# Altium schematic sheet GMSL_DESERIALIZER.SchDoc
size C; SheetNumber: 14; SheetTotal: 17
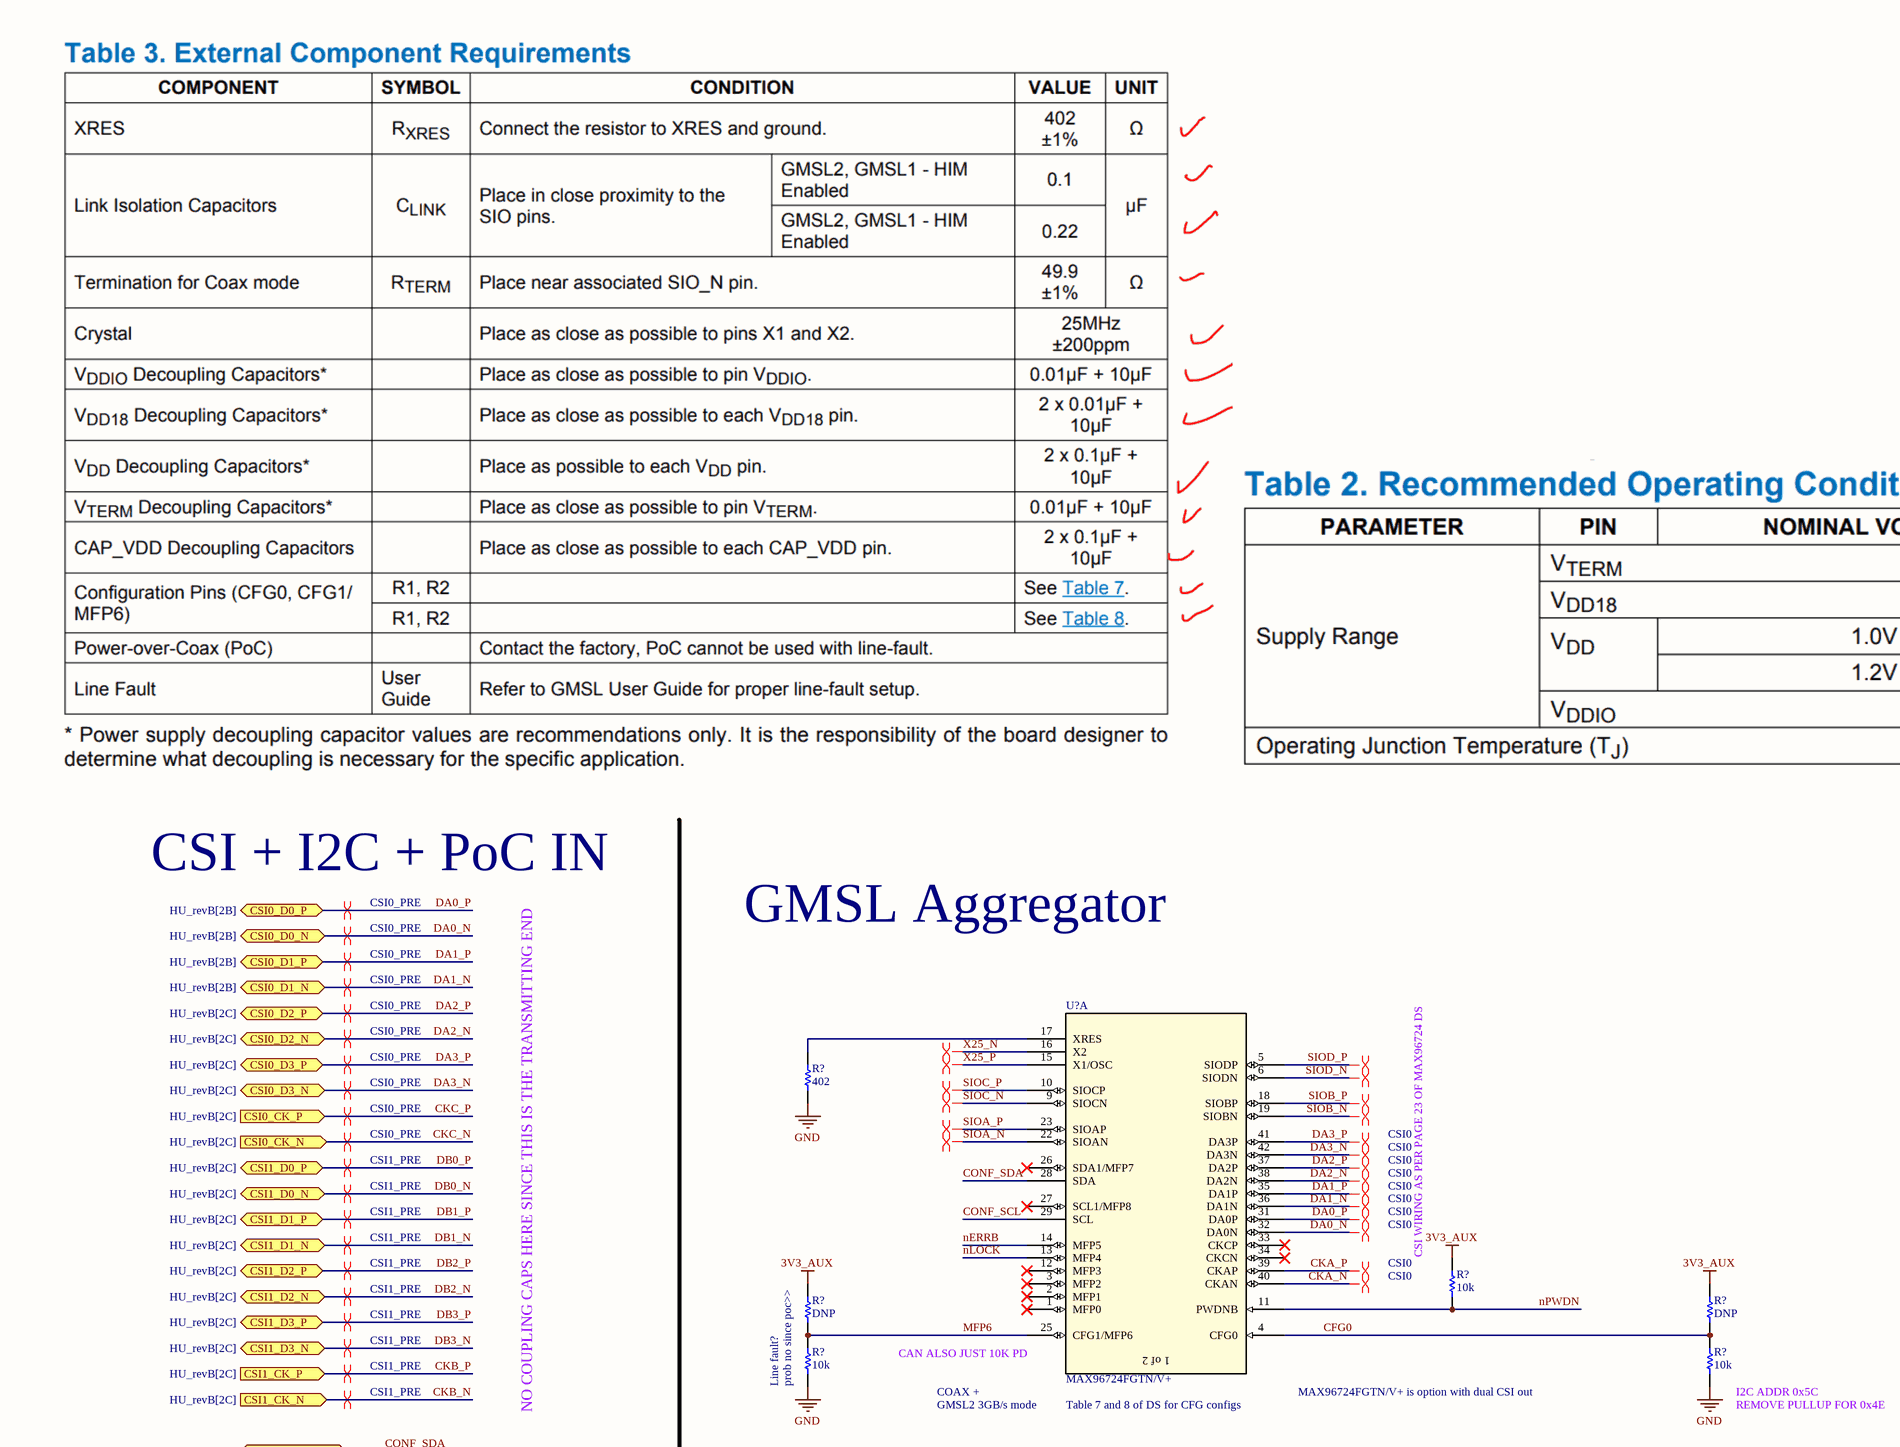
[diagram p0: GMSL_DESERIALIZER.SchDoc, top left]
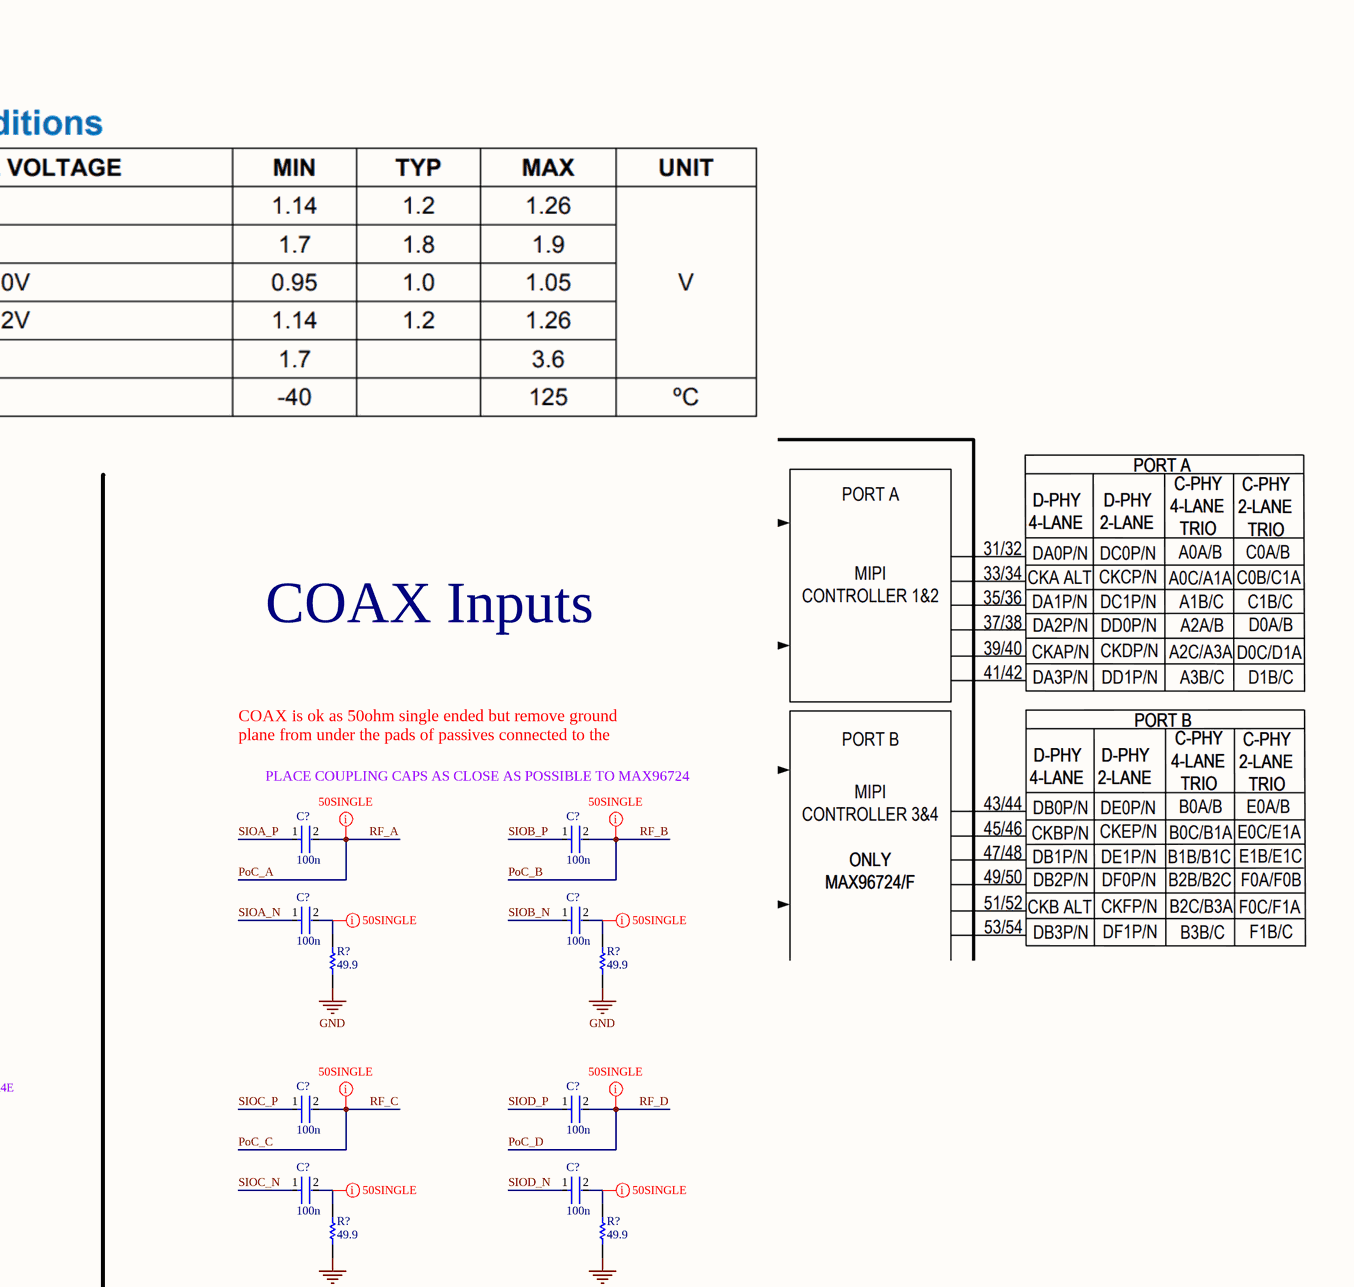
[diagram p1: GMSL_DESERIALIZER.SchDoc, top right]
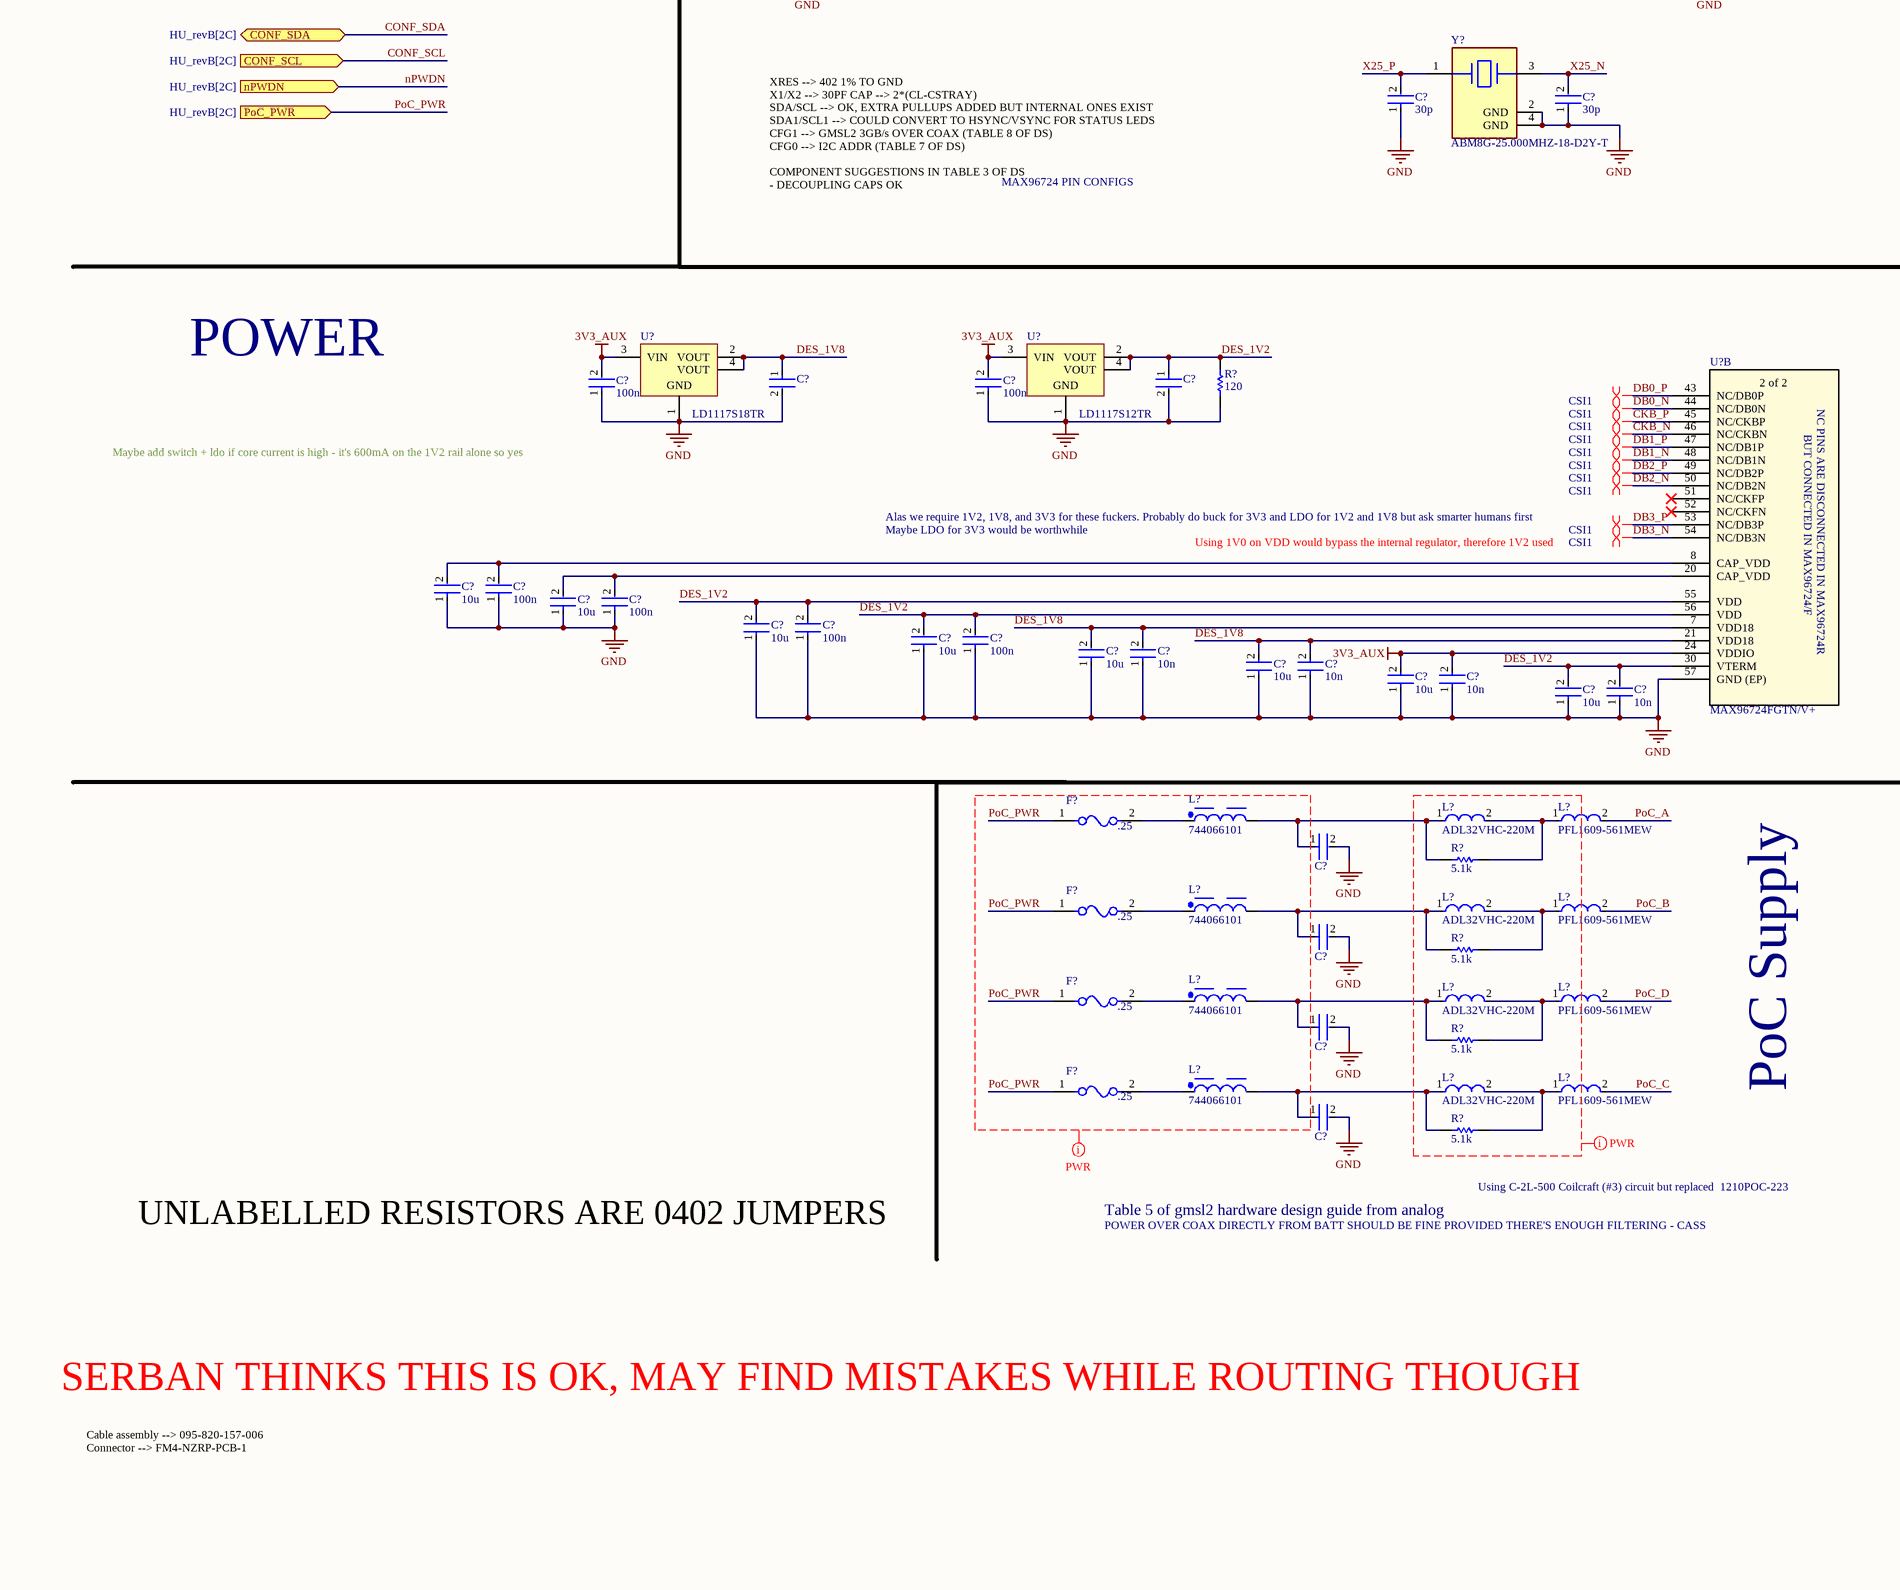
[diagram p2: GMSL_DESERIALIZER.SchDoc, bottom left]
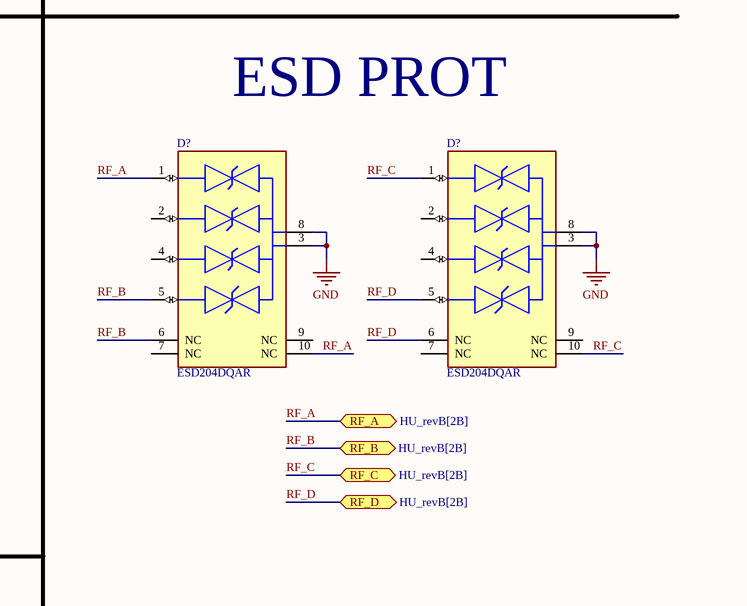
[diagram p3: GMSL_DESERIALIZER.SchDoc, bottom right]

## Parts
(Parts that share a designator on the sheet are numbered #1, #2 ... from top to bottom, then left to right.)
C?#1  100n  [FP-0402-L_1_0_0_05-W_0_5-IPC_A]
C?#2  100n  [FP-0402-L_1_0_0_05-W_0_5-IPC_A]
C?#3  100n  [FP-0402-L_1_0_0_05-W_0_5-IPC_A]
C?#4  100n  [FP-0402-L_1_0_0_05-W_0_5-IPC_A]
C?#5  100n  [FP-0402-L_1_0_0_05-W_0_5-IPC_A]
C?#6  100n  [FP-0402-L_1_0_0_05-W_0_5-IPC_A]
C?#7  100n  [FP-0402-L_1_0_0_05-W_0_5-IPC_A]
C?#8  100n  [FP-0402-L_1_0_0_05-W_0_5-IPC_A]
C?#9  30p  [FP-0402-L_1_0_0_05-W_0_5-IPC_A]
C?#10  30p  [FP-0402-L_1_0_0_05-W_0_5-IPC_A]
C?#11  GRM188R60J106ME47D  [FP-GRM188-0_1-e0_2_0_55-IPC_A]  (value not drawn)
C?#12  GRM188R60J106ME47D  [FP-GRM188-0_1-e0_2_0_55-IPC_A]  (value not drawn)
C?#13  100n  [FP-0402-L_1_0_0_05-W_0_5-IPC_A]
C?#14  100n  [FP-0402-L_1_0_0_05-W_0_5-IPC_A]
C?#15  10u  [FP-0402-L_1_0_0_05-W_0_5-IPC_A]
C?#16  100n  [FP-0402-L_1_0_0_05-W_0_5-IPC_A]
C?#17  10u  [FP-0402-L_1_0_0_05-W_0_5-IPC_A]
C?#18  100n  [FP-0402-L_1_0_0_05-W_0_5-IPC_A]
C?#19  10u  [FP-0402-L_1_0_0_05-W_0_5-IPC_A]
C?#20  100n  [FP-0402-L_1_0_0_05-W_0_5-IPC_A]
C?#21  10u  [FP-0402-L_1_0_0_05-W_0_5-IPC_A]
C?#22  100n  [FP-0402-L_1_0_0_05-W_0_5-IPC_A]
C?#23  10u  [FP-0402-L_1_0_0_05-W_0_5-IPC_A]
C?#24  10n  [FP-0402-L_1_0_0_05-W_0_5-IPC_A]
C?#25  10u  [FP-0402-L_1_0_0_05-W_0_5-IPC_A]
C?#26  10n  [FP-0402-L_1_0_0_05-W_0_5-IPC_A]
C?#27  10u  [FP-0402-L_1_0_0_05-W_0_5-IPC_A]
C?#28  10n  [FP-0402-L_1_0_0_05-W_0_5-IPC_A]
C?#29  10u  [FP-0402-L_1_0_0_05-W_0_5-IPC_A]
C?#30  10n  [FP-0402-L_1_0_0_05-W_0_5-IPC_A]
C?#31  GRM21BR61E226ME44L  [FP-GRM21B-0_2-e0_2_0_7-IPC_B]  (value not drawn)
C?#32  GRM21BR61E226ME44L  [FP-GRM21B-0_2-e0_2_0_7-IPC_B]  (value not drawn)
C?#33  GRM21BR61E226ME44L  [FP-GRM21B-0_2-e0_2_0_7-IPC_B]  (value not drawn)
C?#34  GRM21BR61E226ME44L  [FP-GRM21B-0_2-e0_2_0_7-IPC_B]  (value not drawn)
D?#1  ESD204DQAR  [FP-DQA0010A-MFG]
D?#2  ESD204DQAR  [FP-DQA0010A-MFG]
F?#1  .25  [FP-0685T-MFG]
F?#2  .25  [FP-0685T-MFG]
F?#3  .25  [FP-0685T-MFG]
F?#4  .25  [FP-0685T-MFG]
L?#1  744066101  [WE-TPC_1038]
L?#2  ADL32VHC-220M  [FP-1210POC-MFG]
L?#3  PFL1609-561MEW  [FP-PFL1609-MFG]
L?#4  744066101  [WE-TPC_1038]
L?#5  ADL32VHC-220M  [FP-1210POC-MFG]
L?#6  PFL1609-561MEW  [FP-PFL1609-MFG]
L?#7  744066101  [WE-TPC_1038]
L?#8  ADL32VHC-220M  [FP-1210POC-MFG]
L?#9  PFL1609-561MEW  [FP-PFL1609-MFG]
L?#10  744066101  [WE-TPC_1038]
L?#11  ADL32VHC-220M  [FP-1210POC-MFG]
L?#12  PFL1609-561MEW  [FP-PFL1609-MFG]
R?#1  402  [R0603B]
R?#2  10k  [R0603B]
R?#3  49.9  [R0603B]
R?#4  49.9  [R0603B]
R?#5  DNP  [R0603B]
R?#6  DNP  [R0603B]
R?#7  10k  [R0603B]
R?#8  10k  [R0603B]
R?#9  49.9  [R0603B]
R?#10  49.9  [R0603B]
R?#11  120  [R0603B]
R?#12  5.1k  [R0603B]
R?#13  5.1k  [R0603B]
R?#14  5.1k  [R0603B]
R?#15  5.1k  [R0603B]
U?#1  MAX96724FGTN/V+  [MAX96724FGTN_V+-Footprint-1]  (part A of 2)
U?#2  LD1117S18TR  [SOT-223_M]
U?#3  LD1117S12TR  [SOT-223_M]
U?#4  MAX96724FGTN/V+  [MAX96724FGTN_V+-Footprint-1]  (part B of 2)
Y?  ABM8G-25.000MHZ-18-D2Y-T  [FP-ABM8G-MFG]

## Ports
CONF_SCL (in, see HU_revB[2C]), CONF_SDA (bidir, see HU_revB[2C]), CSI0_CK_N (in, see HU_revB[2C]), CSI0_CK_P (in, see HU_revB[2C]), CSI0_D0_N (bidir, see HU_revB[2B]), CSI0_D0_P (bidir, see HU_revB[2B]), CSI0_D1_N (bidir, see HU_revB[2B]), CSI0_D1_P (bidir, see HU_revB[2B]), CSI0_D2_N (bidir, see HU_revB[2C]), CSI0_D2_P (bidir, see HU_revB[2C]), CSI0_D3_N (bidir, see HU_revB[2C]), CSI0_D3_P (bidir, see HU_revB[2C]), CSI1_CK_N (in, see HU_revB[2C]), CSI1_CK_P (in, see HU_revB[2C]), CSI1_D0_N (bidir, see HU_revB[2C]), CSI1_D0_P (bidir, see HU_revB[2C]), CSI1_D1_N (bidir, see HU_revB[2C]), CSI1_D1_P (bidir, see HU_revB[2C]), CSI1_D2_N (bidir, see HU_revB[2C]), CSI1_D2_P (bidir, see HU_revB[2C]), CSI1_D3_N (bidir, see HU_revB[2C]), CSI1_D3_P (bidir, see HU_revB[2C]), nPWDN (in, see HU_revB[2C]), PoC_PWR (in, see HU_revB[2C]), RF_A (bidir, see HU_revB[2B]), RF_B (bidir, see HU_revB[2B]), RF_C (bidir, see HU_revB[2B]), RF_D (bidir, see HU_revB[2B])

## Nets
3V3_AUX: C?#13.2 C?#14.2 C?#27.2 C?#28.2 R?#2.2 R?#5.2 R?#6.2 U?#2.3(VIN) U?#3.3(VIN) U?#4.24(VDDIO)
GND: C?#9.1 C?#10.1 C?#11.2 C?#12.2 C?#13.1 C?#14.1 C?#15.1 C?#16.1 C?#17.1 C?#18.1 C?#19.1 C?#20.1 C?#21.1 C?#22.1 C?#23.1 C?#24.1 C?#25.1 C?#26.1 C?#27.1 C?#28.1 C?#29.1 C?#30.1 C?#31.2 C?#32.2 C?#33.2 C?#34.2 D?#1.3(GND) D?#1.8(GND) D?#2.3(GND) D?#2.8(GND) R?#1.1 R?#3.1 R?#4.1 R?#7.1 R?#8.1 R?#9.1 R?#10.1 R?#11.1 U?#2.1(GND) U?#3.1(GND) U?#4.57(GND_(EP)) Y?.2(GND) Y?.4(GND)
CFG0: R?#6.1 R?#8.2 U?#1.4(CFG0)
CKA_N: U?#1.40(CKAN)
CKA_P: U?#1.39(CKAP)
CKB_N: U?#4.46(NC/CKBN) ; port CSI1_CK_N
CKB_P: U?#4.45(NC/CKBP) ; port CSI1_CK_P
CKC_N: port CSI0_CK_N
CKC_P: port CSI0_CK_P
CONF_SCL: U?#1.29(SCL) ; port CONF_SCL
CONF_SDA: U?#1.28(SDA) ; port CONF_SDA
DA0_N: U?#1.32(DA0N) ; port CSI0_D0_N
DA0_P: U?#1.31(DA0P) ; port CSI0_D0_P
DA1_N: U?#1.36(DA1N) ; port CSI0_D1_N
DA1_P: U?#1.35(DA1P) ; port CSI0_D1_P
DA2_N: U?#1.38(DA2N) ; port CSI0_D2_N
DA2_P: U?#1.37(DA2P) ; port CSI0_D2_P
DA3_N: U?#1.42(DA3N) ; port CSI0_D3_N
DA3_P: U?#1.41(DA3P) ; port CSI0_D3_P
DB0_N: U?#4.44(NC/DB0N) ; port CSI1_D0_N
DB0_P: U?#4.43(NC/DB0P) ; port CSI1_D0_P
DB1_N: U?#4.48(NC/DB1N) ; port CSI1_D1_N
DB1_P: U?#4.47(NC/DB1P) ; port CSI1_D1_P
DB2_N: U?#4.50(NC/DB2N) ; port CSI1_D2_N
DB2_P: U?#4.49(NC/DB2P) ; port CSI1_D2_P
DB3_N: U?#4.54(NC/DB3N) ; port CSI1_D3_N
DB3_P: U?#4.53(NC/DB3P) ; port CSI1_D3_P
DES_1V2: C?#12.1 C?#19.2 C?#20.2 C?#21.2 C?#22.2 C?#29.2 C?#30.2 R?#11.2 U?#3.2(VOUT) U?#3.4(VOUT) U?#4.30(VTERM) U?#4.55(VDD) U?#4.56(VDD)
DES_1V8: C?#11.1 C?#23.2 C?#24.2 C?#25.2 C?#26.2 U?#2.2(VOUT) U?#2.4(VOUT) U?#4.7(VDD18) U?#4.21(VDD18)
MFP6: R?#5.1 R?#7.2 U?#1.25(CFG1/MFP6)
nERRB: U?#1.14(MFP5)
nLOCK: U?#1.13(MFP4)
nPWDN: R?#2.1 U?#1.11(PWDNB) ; port nPWDN
PoC_A: C?#1.2 D?#1.1(IO1) D?#1.10(NC) L?#3.2 ; port RF_A  [also labelled RF_A]
PoC_B: C?#2.2 D?#1.5(IO4) D?#1.6(NC) L?#6.2 ; port RF_B  [also labelled RF_B]
PoC_C: C?#5.2 D?#2.1(IO1) D?#2.10(NC) L?#12.2 ; port RF_C  [also labelled RF_C]
PoC_D: C?#6.2 D?#2.5(IO4) D?#2.6(NC) L?#9.2 ; port RF_D  [also labelled RF_D]
PoC_PWR: F?#1.1 F?#2.1 F?#3.1 F?#4.1 ; port PoC_PWR
SIOA_N: C?#3.1 U?#1.22(SIOAN)
SIOA_P: C?#1.1 U?#1.23(SIOAP)
SIOB_N: C?#4.1 U?#1.19(SIOBN)
SIOB_P: C?#2.1 U?#1.18(SIOBP)
SIOC_N: C?#7.1 U?#1.9(SIOCN)
SIOC_P: C?#5.1 U?#1.10(SIOCP)
SIOD_N: C?#8.1 U?#1.6(SIODN)
SIOD_P: C?#6.1 U?#1.5(SIODP)
X25_N: C?#10.2 U?#1.16(X2) Y?.3
X25_P: C?#9.2 U?#1.15(X1/OSC) Y?.1
NetC?#3_2: C?#3.2 R?#3.2
NetC?#4_2: C?#4.2 R?#4.2
NetC?#7_2: C?#7.2 R?#9.2
NetC?#8_2: C?#8.2 R?#10.2
NetC?#15_2: C?#15.2 C?#16.2 U?#4.8(CAP_VDD)
NetC?#17_2: C?#17.2 C?#18.2 U?#4.20(CAP_VDD)
NetC?#31_1: C?#31.1 L?#1.2 L?#2.1 R?#12.2
NetC?#32_1: C?#32.1 L?#4.2 L?#5.1 R?#13.2
NetC?#33_1: C?#33.1 L?#7.2 L?#8.1 R?#14.2
NetC?#34_1: C?#34.1 L?#10.2 L?#11.1 R?#15.2
NetF?#1_2: F?#1.2 L?#1.1
NetF?#2_2: F?#2.2 L?#4.1
NetF?#3_2: F?#3.2 L?#7.1
NetF?#4_2: F?#4.2 L?#10.1
NetL?#2_2: L?#2.2 L?#3.1 R?#12.1
NetL?#5_2: L?#5.2 L?#6.1 R?#13.1
NetL?#8_2: L?#8.2 L?#9.1 R?#14.1
NetL?#11_2: L?#11.2 L?#12.1 R?#15.1
NetR?#1_2: R?#1.2 U?#1.17(XRES)

Not connected (* = marked no-connect by the designer): D?#1 2(IO2) 4(IO3) 7(NC) 9(NC); D?#2 2(IO2) 4(IO3) 7(NC) 9(NC); U?#1 1(MFP0)* 2(MFP1)* 3(MFP2)* 12(MFP3)* 26(SDA1/MFP7)* 27(SCL1/MFP8)* 33(CKCP)* 34(CKCN)*; U?#4 51(NC/CKFP)* 52(NC/CKFN)*

## Layout directives
differential pair; differential pair class CSI0: CKA_N, CKA_P, DA0_N, DA0_P, DA1_N, DA1_P, DA2_N, DA2_P, DA3_N, DA3_P
differential pair; differential pair class 100DIFF: SIOA_N, SIOA_P, SIOB_N, SIOB_P, SIOC_N, SIOC_P, SIOD_N, SIOD_P
differential pair: X25_N, X25_P
differential pair; differential pair class CSI1: CKB_N, CKB_P, DB0_N, DB0_P, DB1_N, DB1_P, DB2_N, DB2_P, DB3_N, DB3_P
net class PWR: (no net found under the mark), PoC_PWR
differential pair; differential pair class CSI0_PRE: CKC_N, CKC_P, DA0_N, DA0_P, DA1_N, DA1_P, DA2_N, DA2_P, DA3_N, DA3_P
differential pair; differential pair class CSI1_PRE: CKB_N, CKB_P, DB0_N, DB0_P, DB1_N, DB1_P, DB2_N, DB2_P, DB3_N, DB3_P
net class 50SINGLE: NetC?#3_2, NetC?#4_2, NetC?#7_2, NetC?#8_2, PoC_A, PoC_B, PoC_C, PoC_D

## Notes on the sheet
- CSI + I2C + PoC IN
- GMSL Aggregator
- COAX Inputs
- COAX is ok as 50ohm single ended but remove ground plane from under the pads of passives connected to the GMSL trace
- PLACE COUPLING CAPS AS CLOSE AS POSSIBLE TO MAX96724
- (near R?#2) CSI WIRING AS PER PAGE 23 OF MAX96724 DS
- (near R?#7) Line fault?
- (near R?#7) prob no since poc>>
- CAN ALSO JUST 10K PD
- NO COUPLING CAPS HERE SINCE THIS IS THE TRANSMITTING END
- GMSL2 3GB/s mode
- COAX +
- Table 7 and 8 of DS for CFG configs
- MAX96724FGTN/V+ is option with dual CSI out
- (near R?#8) I2C ADDR 0x5C
- (near R?#8) REMOVE PULLUP FOR 0x4E
- XRES --> 402 1% TO GND
  X1/X2 --> 30PF CAP --> 2*(CL-CSTRAY)
  SDA/SCL --> OK, EXTRA PULLUPS ADDED BUT INTERNAL ONES EXIST
  SDA1/SCL1 --> COULD CONVERT TO HSYNC/VSYNC FOR STATUS LEDS
  CFG1 --> GMSL2 3GB/s OVER COAX (TABLE 8 OF DS)
  CFG0 --> I2C ADDR (TABLE 7 OF DS)
  COMPONENT SUGGESTIONS IN TABLE 3 OF DS
  - DECOUPLING CAPS OK
- MAX96724 PIN CONFIGS
- ESD PROT
- POWER
- Maybe add switch + ldo if core current is high - it's 600mA on the 1V2 rail alone so yes
- Alas we require 1V2, 1V8, and 3V3 for these fuckers. Probably do buck for 3V3 and LDO for 1V2 and 1V8 but ask smarter humans first
- Maybe LDO for 3V3 would be worthwhile
- Using 1V0 on VDD would bypass the internal regulator, therefore 1V2 used
- PoC Supply
- Using C-2L-500 Coilcraft (#3) circuit but replaced  1210POC-223
- UNLABELLED RESISTORS ARE 0402 JUMPERS
- Table 5 of gmsl2 hardware design guide from analog
- POWER OVER COAX DIRECTLY FROM BATT SHOULD BE FINE PROVIDED THERE'S ENOUGH FILTERING - CASS
- SERBAN THINKS THIS IS OK, MAY FIND MISTAKES WHILE ROUTING THOUGH
- Cable assembly --> 095-820-157-006
  Connector --> FM4-NZRP-PCB-1
- (in symbol CMP-015-00011-2, part A) 1 of 2
- (in symbol CMP-015-00011-2, part B) 2 of 2; NC PINS ARE DISCONNECTED IN MAX96724R; BUT CONNECTED IN MAX96724/F

## Library data of the parts
C?#1-C?#10 C?#13-C?#30 = CMP-001-00058-1: LARGE PADS, 0402 CAP, CHANGE COMMENT TO MATCH REAL P/N; Capacitor Type: Ceramic; Min Operating Temperature: -55°C; Mounting Technology: Surface Mount; Pins: 2; Case/Package: 0402; RoHS Compliant: Yes; Max Operating Temperature: 85°C
C?#11 C?#12 = CMP-2006-02792-2: Chip Multilayer Ceramic Capacitors for General Purpose, 0603, 10uF, X5R, 15%, 20%, 6.3V; Packaging: Tape and Reel; Voltage Rating (DC): 6.3V; Width: 0.031inch; Termination: SMD/SMT; Dielectric: X5R; Package Quantity: 4000; Voltage Rating: 6.3V; Capacitance: 10uF; Case/Package: 0603; Min Operating Temperature: -55°C; Voltage: 6.3V; Length: 1.6mm; Thickness: 0.035inch; Lead Free: Lead Free; Depth: 0.8mm; Case Code (Imperial): 0603; Max Operating Temperature: 85°C; Material: Ceramic; Height: 0.8mm; Tolerance: 20%; Mount: Surface Mount; REACH SVHC: No SVHC; Radiation Hardening: No; Case Code (Metric): 1608
C?#31-C?#34 = CMP-2007-03222-3: Chip Multilayer Ceramic Capacitors for General Purpose, 0805, 22uF, X5R, 15%, 20%, 25V; Case/Package: 0805; Depth: 1.25mm; Resistor Type: Ceramic; Voltage Rating: 25V; Lead Free: Lead Free; Voltage Rating (DC): 25V; Case Code (Metric): 2012; Thickness: 0.057inch; REACH SVHC: No SVHC; Material: Ceramic; Tolerance: 20%; Length: 2mm; Capacitance: 22uF; Case Code (Imperial): 0805; Max Operating Temperature: 85°C; Termination: SMD/SMT; Weight: 0.000335oz; Dielectric: X5R; Packaging: Tape and Reel; Voltage: 25V; Package Quantity: 3000; Height: 1.25mm; Mount: Surface Mount; Width: 1.25mm; Min Operating Temperature: -55°C
D?#1 D?#2 = CMP-04989-000002-1: 4-CHANNEL LOW-CAPACITANCE SURGE; Manufacturer: Texas Instruments; Value: 0.55pF; Reverse Standoff Voltage: 3.6V; Standoff Height: 0mm; Breakdown Voltage: 5.5V; Peak Pulse Current: 5.5A; Clamping Voltage: 11.5V; Direction: Bidirectional; Peak Pulse Power: 50W; Number Of Channels: 4; Ambient Temperature Range High: +125°C; ComponentLink2Description: Datasheet; Height: 0.55mm; Lead Free: Yes; Device Class L3: unset; Temperature Range High: +125°C; Temperature Range Low: -40°C; Package: DQA0010A; Temperature: -40°C to +125°C; Capacitance: 0.55pF; RoHS: TRUE; Mouser Description: 4-Channel Low-Capacitance Surge and ESD Protection Diode 10-USON -40 to 125; Category: Diode; Device Class L1: Circuit Protection; Octopart: https://octopart.com/esd204dqar-texas+instruments-89917476; Device Class L2: TVS Diodes; Ambient Temperature Range Low: -40°C; Manufacturer Part Number: ESD204DQAR; ComponentLink2URL: http://www.ti.com/lit/ds/symlink/esd204.pdf; Automotive: No; Digikey Description: 4-CHANNEL LOW-CAPACITANCE SURGE
F?#1-F?#4 = CMP-16042-000006-1: FUSE BOARD MNT 5A 63VAC/VDC 1206; RoHS Compliant: Yes
L?#1 L?#4 L?#7 L?#10 = CMP-0227-00094-3: NexarPartId: 8917123; Current Rating: 1.2A; Shielding: Shielded; Core Material: Ferrite; Inductance: 100µH; Test Frequency: 100kHz; Tolerance: 30%; Resistance: 255mΩ; Self Resonant Frequency: 6MHz; Composition: Wirewound; Packaging: Cut Tape (CT); REACH SVHC: Unknown; Number of Pins: 2; Max DC Current: 1.2A; Saturation Current: 1.2A; Ambient Temperature Range High: 95°C; Weight: 1.273007g; Height: 3.8mm; Width: 10mm; Min Operating Temperature: -40°C; Max Operating Temperature: 125°C; Termination: SMD/SMT; Height - Seated (Max): 4.0894mm; Length: 10mm; RMS Current (Irms): 1.2A; Ambient Temperature Range Low: -40°C; RoHS: Compliant; Mount: Surface Mount; Depth: 10mm; DC Resistance (DCR): 255mΩ; Inductance Tolerance: 30%; Case/Package: Nonstandard
L?#2 L?#5 L?#8 L?#11 = CMP-11268-000041-1: NOT COILCRAFT - ACTUAL P# --> ADL32VHC-220M / - Power Injection Chokes for PoC; Manufacturer Part Number: 1210POC-223MRC; Value: 22uH; Core Material: Ferrite; Saturation Current: 720mA; Series Resistance: 0.88Ω; Rms Current: 700mA; Automotive Grade: Grade 1; Self Resonant Frequency: 70MHz; Test Frequency: 100kHz; Tolerance: 20%; Ambient Temperature Range High: +125°C; Manufacturer: coilcraft; Octopart: https://octopart.com/1210poc-223mrc-coilcraft-103207315; Category: Ind; Device Class L2: Inductors; RoHS: TRUE; Device Class L3: Fixed Inductors; Package: 1210POC; Ambient Temperature Range Low: -40°C; ComponentLink2URL: https://drive.google.com/open?id=15FlOq8Y4YbRFohfA_cJ40jgnqs8va2Mh; Lead Free: Yes; Inductance: 22uH; Device Class L1: Passive Components; ComponentLink2Description: Datasheet; Automotive: Yes; Height: 3mm
L?#3 L?#6 L?#9 L?#12 = CMP-11268-000007-1: Fixed Inductors PFL1609 Low Profile 0.56 uH 20 % 1.4 A; Manufacturer: coilcraft; Rms Current: 1100mA; Self Resonant Frequency: 600MHz; Core Material: Composite; Tolerance: 20%; Value: 0.56uH; Automotive Grade: Grade 1; Saturation Current: 710mA; Test Frequency: 7.9MHz; Shielding: true; Series Resistance: 130mΩ; Lead Free: Yes; Device Class L1: Passive Components; Package: PFL1609; Octopart: https://octopart.com/pfl1609-561mew-coilcraft-20329171; ComponentLink2URL: https://www.coilcraft.com/pdfs/pfl1609.pdf; Manufacturer Part Number: PFL1609-561MEW; Ambient Temperature Range Low: -40°C; Composition: Wirewound; Inductance: 0.56uH; Device Class L2: Inductors; Category: Ind; Device Class L3: Fixed Inductors; Mouser Description: Fixed Inductors PFL1609 Low Profile 0.56 uH 20 % 1.4 A; Automotive: Yes; ComponentLink2Description: Datasheet; Ambient Temperature Range High: +105°C; Height: 0.95mm; RoHS: TRUE
R?#1-R?#15 = CMP-009-00002-14: Resistor
U?#1 U?#4 = CMP-015-00011-2: Quad Tunneling GMSL2/1 to CSI-2 Deserializer
U?#2 = CMP-0244-00308-1: Fixed Low Drop Positive Voltage Regulator, 1.8V, 4-Pin SOT-223, Tape and Reel; ComponentLink1URL: http://www.st.com; PackageReference: SOT-223; PackageDescription: 4-Pin SOT-223 Package, 6.5 x 3.5 mm Body, 2.3 mm Pitch, 7 mm Lead Span; ComponentLink2URL: http://www.st.com/internet/com/TECHNICAL_RESOURCES/TECHNICAL_LITERATURE/DATASHEET/CD00000544.pdf; ComponentLink2Description: Datasheet; ComponentLink1Description: Manufacturer URL; DatasheetVersion: 1/11/2011; PackageVersion: 2010
U?#3 = CMP-0244-00318-1: Fixed Low Drop Positive Voltage Regulator, 1.2V, 4-Pin SOT-223, Tape and Reel; PackageDescription: 4-Pin SOT-223 Package, 6.5 x 3.5 mm Body, 2.3 mm Pitch, 7 mm Lead Span; PackageVersion: 2010; ComponentLink2Description: Datasheet; PackageReference: SOT-223; ComponentLink2URL: http://www.st.com/internet/com/TECHNICAL_RESOURCES/TECHNICAL_LITERATURE/DATASHEET/CD00000544.pdf; ComponentLink1Description: Manufacturer URL; DatasheetVersion: 1/11/2011; ComponentLink1URL: http://www.st.com
Y? = CMP-2000-05733-3: Crystal 25MHz ±20ppm (Tol) ±30ppm (Stability) 18pF FUND 60Ω 4-Pin SMD T/R; Series Resistance: 60R; Length: 3.2mm; Depth: 2.5mm; Packaging: Tape and Reel; Min Operating Temperature: -40°C; Operating Frequency: 25 MHz; Lead Free: Lead Free; Number of Pins: 4; Frequency Tolerance: 20ppm; Radiation Hardening: No; Max Operating Temperature: 85°C; Termination: SMD/SMT; Frequency Stability: 30ppm; Frequency: 25MHz; Series: ABM8G; Mount: Surface Mount; Package Quantity: 1000; Height: 0.039inch; Width: 0.098inch; Case/Package: CSMD; ESR (Equivalent Series Resistance): 60R; Load Capacitance: 18pF; Tolerance: 20ppm